# EasyEDA Pro project 测试用途.eprj, board ESP32 CH340下载电路
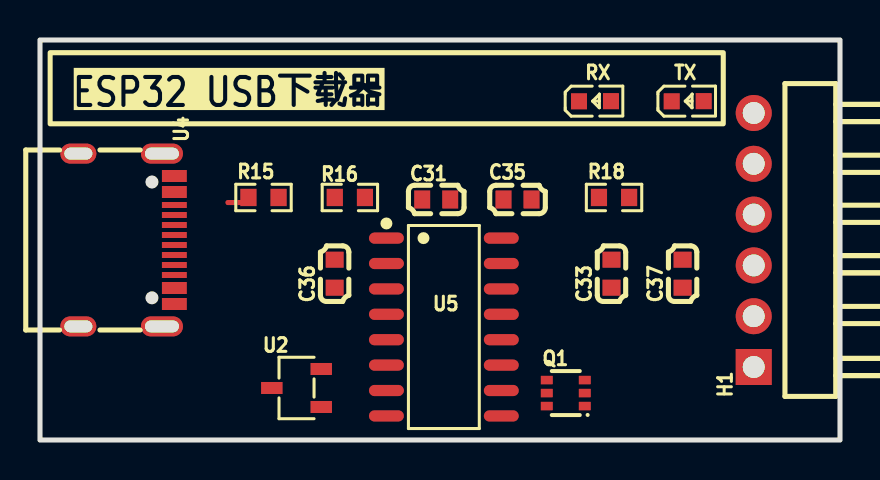
[diagram p15: board, top side]
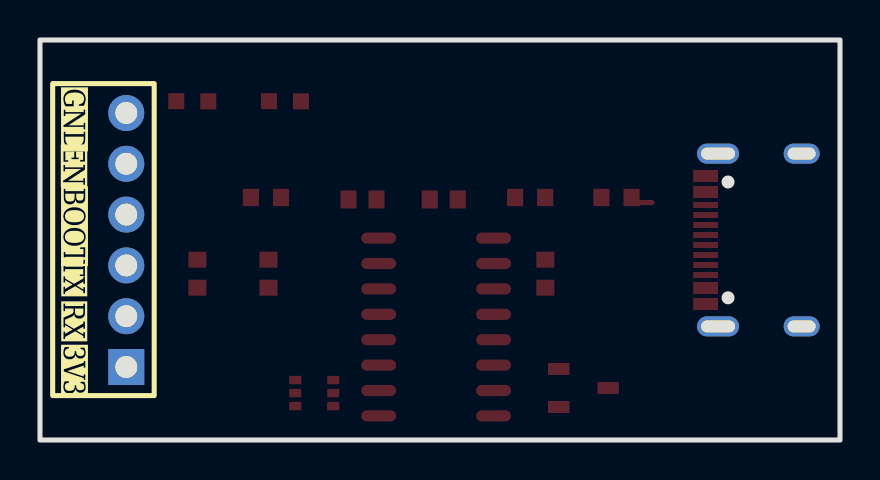
[diagram p16: board, bottom side, seen from below]

Outline 40 x 20 mm; copper layers: Top Layer, GND, 3V3, Bottom Layer. Coordinates in mm from the lower left corner of the outline.
Outline path: rectangle 0,20 40,0
Stack: Top Layer 0.035mm 外层铜厚1oz / Dielectric1 0.2104mm 7628 RC49% 8.6mil / GND 0.0152mm 内层铜厚 / Dielectric2 1.065mm 1.1mm H/HOZ Copper / 3V3 0.0152mm 内层铜厚 / Dielectric3 0.2104mm 7628 RC49% 8.6mil / Bottom Layer 0.035mm 外层铜厚1oz

## Design rules (mm)
template: JLCPCB Capability(Two Layers Board)
spacing copperThickness1oz (default): track to track 0.102, other pairs 0.152 to 0.3
spacing copperThickness2oz: track to track 0.203, other pairs 0.152 to 0.3
track width copperThickness1oz (default): min 0.127, default 0.254, max 2.54
track width copperThickness2oz: min 0.203, default 0.254, max 2.54
differential pair differentialPair (default): width min 0.127, default 0.254, max 2.54; gap min 0.152, default 0.152
via viaSize (default): diameter min 0.5, default 0.61, max 10; hole min 0.3, default 0.305, max 6.3

## Placement (name value [footprint] x y rotation side)
C31  100nF  [C0603]  19.81 12.03 180 top
C33  1uF  [C0603]  28.57 8.32 90 top
C35  1uF  [C0603]  23.88 12.03 0 top
C36  1uF  [C0603]  14.73 8.32 90 top
C37  22uF  [C0603]  32.13 8.32 90 top
H1  PZ254R-11-06P  [HDR-TH_6P-P2.54-H-M-W10.4]  35.69 10 90 top
Q1  UMH3N  [SC-70-6_L2.2-W1.3-P0.65-LS2.1-BR]  26.29 2.35 0 top
R15  5.1kΩ  [R0603]  11.18 12.13 0 top
R16  5.1kΩ  [R0603]  15.49 12.13 0 top
R18  300Ω  [R0603]  28.7 12.13 0 top
RX  XL-1608SURC-06  [LED0603-RD_RED]  27.75 16.94 0 top
TX  XL-1608SURC-06  [LED0603-RD_RED]  32.38 16.94 0 top
U2  ME6211A33M3G-N  [SOT-23-3_L2.9-W1.6-P1.90-LS2.8-BR]  12.83 2.6 0 top
U4  GT-USB-7010ASV  [USB-C-SMD_G-SWITCH_GT-USB-7010ASV]  4.32 10 270 top
U5  CH340C  [SOP-16_L10.0-W3.9-P1.27-LS6.0-BL]  20.19 5.65 270 top

## Footprints (pads in the part's own frame, mm; a bottom-side part is the same pattern mirrored in y, then rotated)
C0603
  rect 0.8x0.9 smd: 1(-0.7,0) 2(0.7,0)
HDR-TH_6P-P2.54-H-M-W10.4
  rect 1.8x1.8 hole 1.1: 1(-6.35,0)
  round 1.8 hole 1.1: 2(-3.81,0) 3(-1.27,0) 4(1.27,0) 5(3.81,0) 6(6.35,0)
LED0603-RD_RED
  rect 0.8x0.8 smd: 1(-0.799,-0.004) 2(0.799,0.004)
R0603
  rect 0.806x0.864 smd: 1(-0.753,0) 2(0.753,0)
SC-70-6_L2.2-W1.3-P0.65-LS2.1-BR
  rect 0.6x0.42 smd: 1(0.95,-0.65) 2(0.95,0) 3(0.95,0.65) 4(-0.95,0.65) 5(-0.95,0) 6(-0.95,-0.65)
SOP-16_L10.0-W3.9-P1.27-LS6.0-BL
  oval 0.56x1.745 smd: 1(-4.445,-2.873) 2(-3.175,-2.873) 3(-1.905,-2.873) 4(-0.635,-2.873) 5(0.635,-2.873) 6(1.905,-2.873) 7(3.175,-2.873) 8(4.445,-2.873) 9(4.445,2.873) 10(3.175,2.873) 11(1.905,2.873) 12(0.635,2.873) 13(-0.635,2.873) 14(-1.905,2.873) 15(-3.175,2.873) 16(-4.445,2.873)
SOT-23-3_L2.9-W1.6-P1.90-LS2.8-BR
  rect 1.07x0.6 smd: 1(1.235,-0.95) 2(1.235,0.95) 3(-1.235,0)
USB-C-SMD_G-SWITCH_GT-USB-7010ASV
  oval 1x2.1 hole 0.6x1.7: 1(-4.32,1.78) 2(4.32,1.78)
  oval 1x1.8 hole 0.6x1.4: 3(4.32,-2.4) 4(-4.32,-2.4)
  rect 0.6x1.24 smd: A1B12(-3.2,2.4) A4B9(-2.4,2.4) B1A12(3.2,2.4) B4A9(2.4,2.4)
  rect 0.3x1.24 smd: A5(-1.25,2.4) A6(-0.25,2.4) A7(0.25,2.4) A8(1.25,2.4) B5(1.75,2.4) B6(0.75,2.4) B7(-0.75,2.4) B8(-1.75,2.4)

## Nets
As in the schematic.

Pads without a net: U4 A8 B6 B7 B8; U5 7 8 9 10 11 12

## Routing (per net, layer and track width the routed paths; a pad name or vN(x,y) marks a point on that pad's centre or on a via; arc(x,y) is an arc through that point)
GND: length 1.1
  Top Layer w0.254: 9.4,11.87 10.12,11.87 10.38,12.13

## Copper pours and planes (outline as drawn; the poured copper is in the pictures)
GND on Top Layer: -0.18,-3.83 45.93,-3.83 45.93,-27.07 -0.18,-27.07
GND on GND: 0.26,19.74 39.74,19.74 39.74,0.26 0.26,0.26
GND on 3V3: 0.26,19.74 39.74,19.74 39.74,0.26 0.26,0.26

Small or netless copper shapes (teardrops, artwork), in the pictures only: 20 on GND, 20 on 3V3

## Text on the board
Bottom Silkscreen Layer: GND | BOOT | 3V3 | EN | TX | RX
Top Silkscreen Layer: ESP32 USB下载器
